# EAGLE schematic 180dof-pm (EAGLE 5.04)
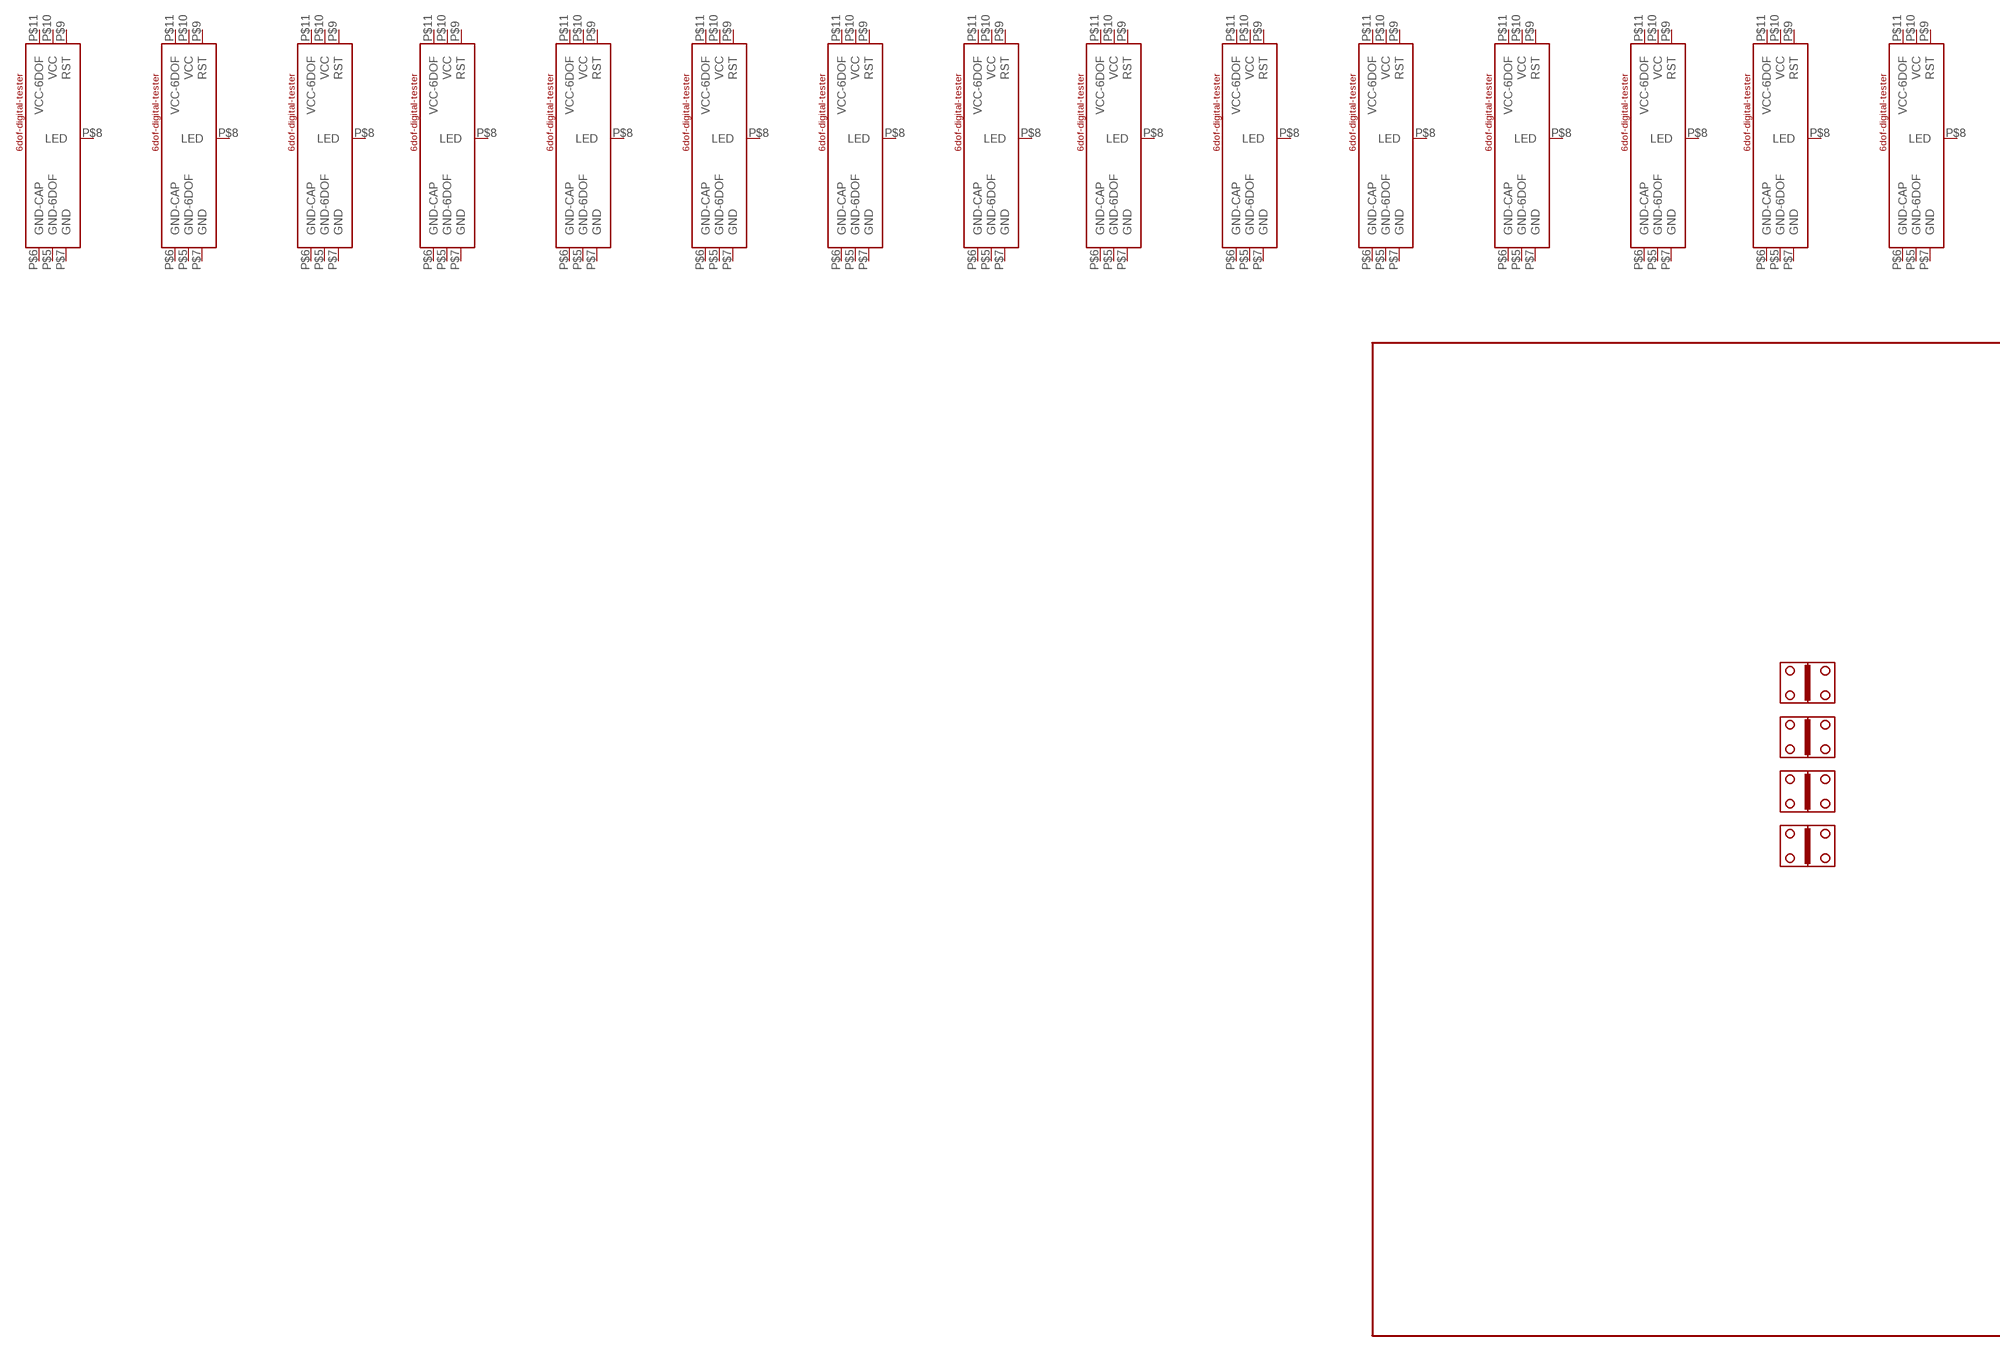
[diagram p0: schematic, sheet 1, part 1 of 2]
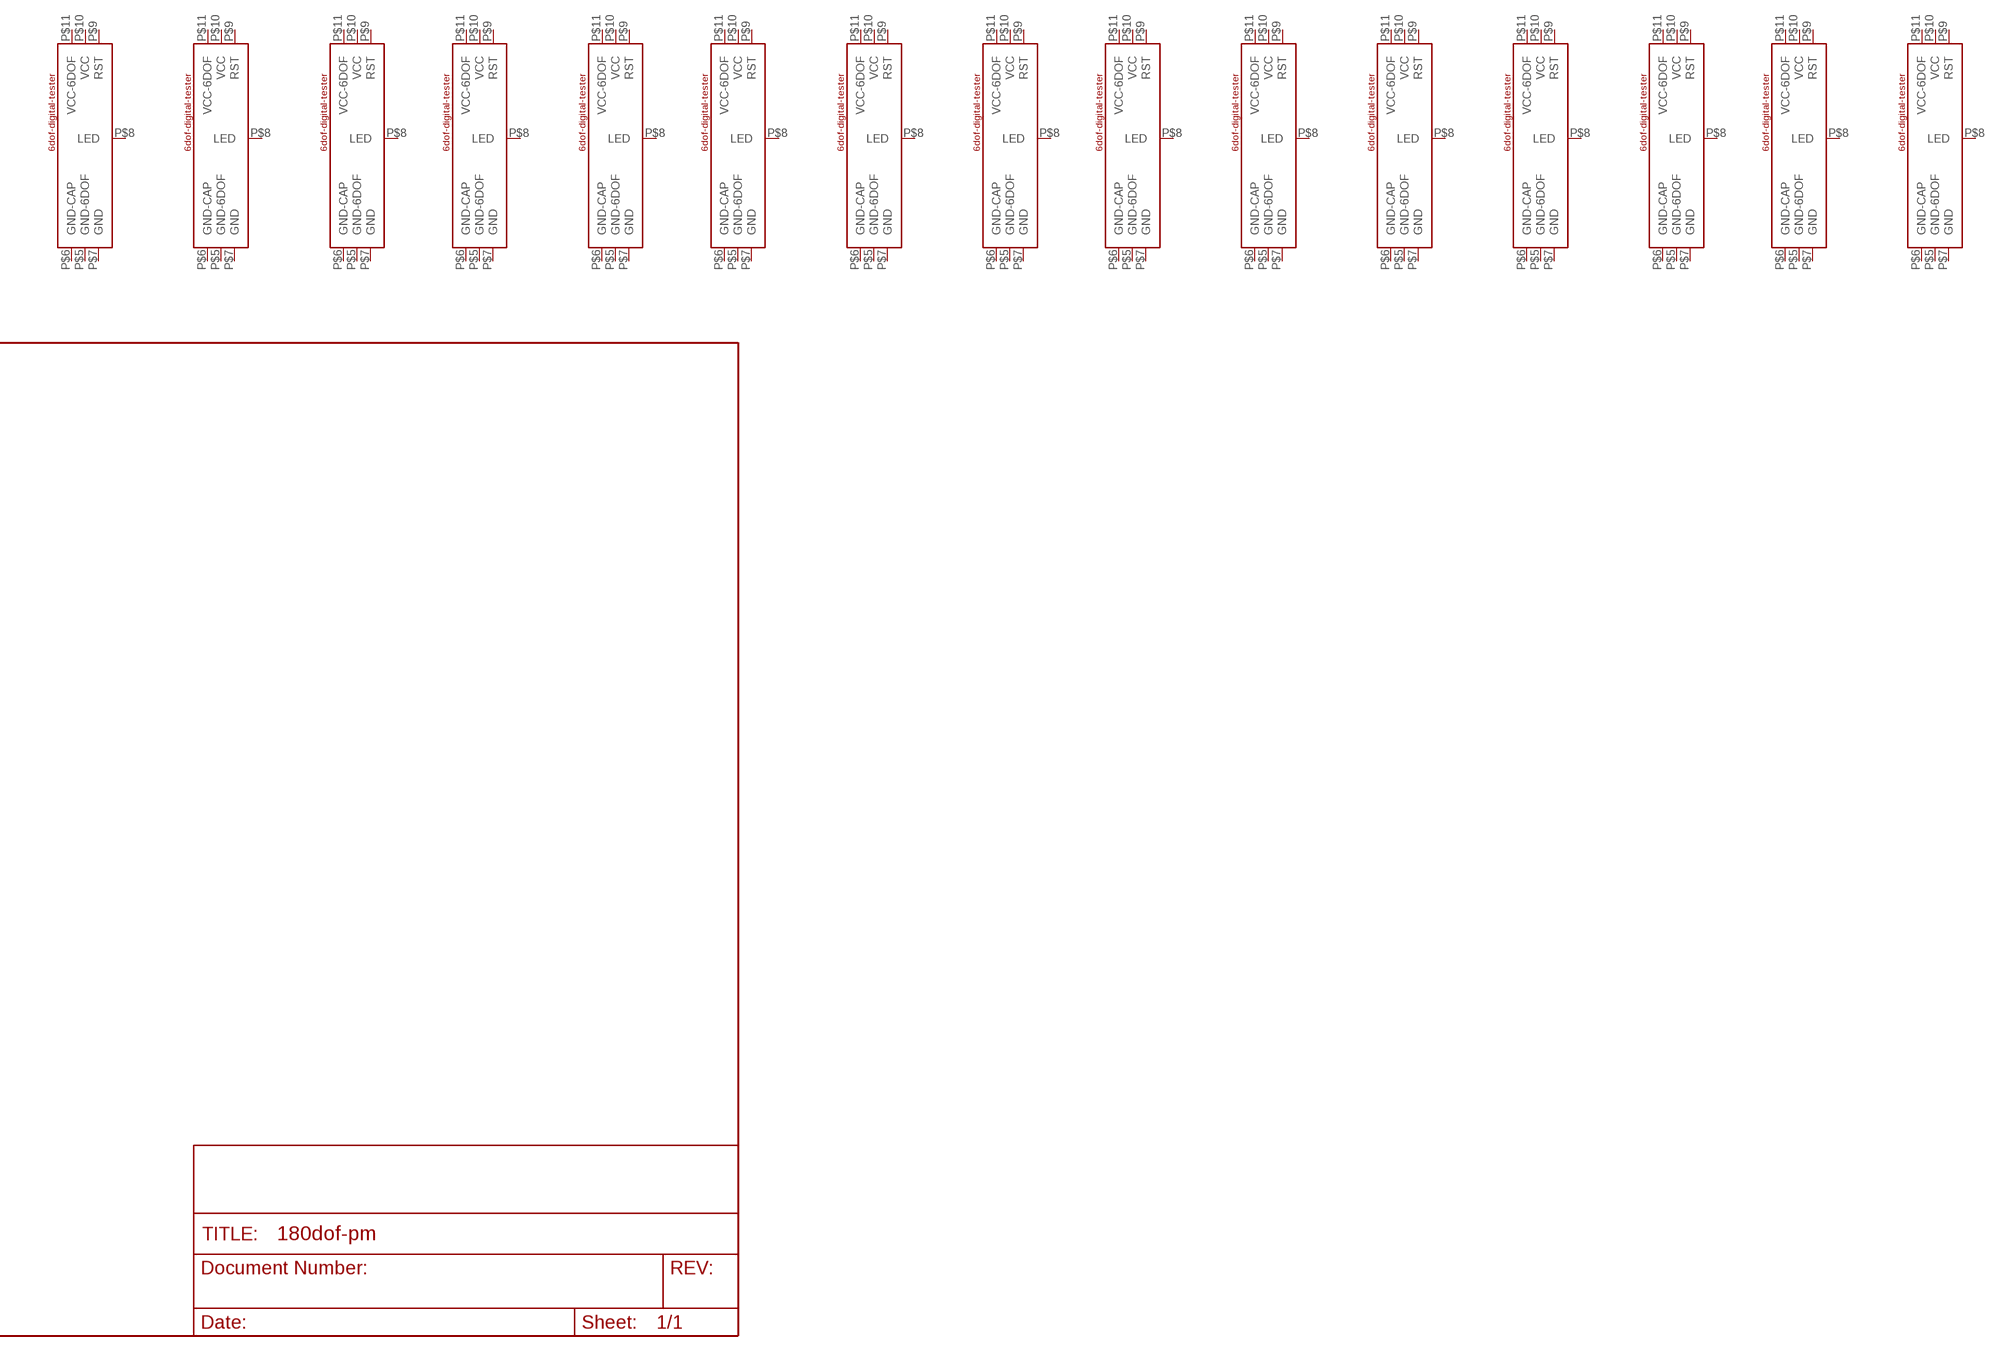
[diagram p1: schematic, sheet 1, part 2 of 2]

## Parts
U$1  6DOF-DIGITAL-TESTER-DEVPM  [6DOF-DIGITAL-TESTER-PM]
U$2  6DOF-DIGITAL-TESTER-DEVPM  [6DOF-DIGITAL-TESTER-PM]
U$3  6DOF-DIGITAL-TESTER-DEVPM  [6DOF-DIGITAL-TESTER-PM]
U$4  6DOF-DIGITAL-TESTER-DEVPM  [6DOF-DIGITAL-TESTER-PM]
U$5  6DOF-DIGITAL-TESTER-DEVPM  [6DOF-DIGITAL-TESTER-PM]
U$6  6DOF-DIGITAL-TESTER-DEVPM  [6DOF-DIGITAL-TESTER-PM]
U$7  6DOF-DIGITAL-TESTER-DEVPM  [6DOF-DIGITAL-TESTER-PM]
U$8  6DOF-DIGITAL-TESTER-DEVPM  [6DOF-DIGITAL-TESTER-PM]
U$9  6DOF-DIGITAL-TESTER-DEVPM  [6DOF-DIGITAL-TESTER-PM]
U$10  6DOF-DIGITAL-TESTER-DEVPM  [6DOF-DIGITAL-TESTER-PM]
U$11  6DOF-DIGITAL-TESTER-DEVPM  [6DOF-DIGITAL-TESTER-PM]
U$12  6DOF-DIGITAL-TESTER-DEVPM  [6DOF-DIGITAL-TESTER-PM]
U$13  6DOF-DIGITAL-TESTER-DEVPM  [6DOF-DIGITAL-TESTER-PM]
U$14  6DOF-DIGITAL-TESTER-DEVPM  [6DOF-DIGITAL-TESTER-PM]
U$15  6DOF-DIGITAL-TESTER-DEVPM  [6DOF-DIGITAL-TESTER-PM]
U$16  6DOF-DIGITAL-TESTER-DEVPM  [6DOF-DIGITAL-TESTER-PM]
U$17  6DOF-DIGITAL-TESTER-DEVPM  [6DOF-DIGITAL-TESTER-PM]
U$18  6DOF-DIGITAL-TESTER-DEVPM  [6DOF-DIGITAL-TESTER-PM]
U$19  6DOF-DIGITAL-TESTER-DEVPM  [6DOF-DIGITAL-TESTER-PM]
U$20  6DOF-DIGITAL-TESTER-DEVPM  [6DOF-DIGITAL-TESTER-PM]
U$21  6DOF-DIGITAL-TESTER-DEVPM  [6DOF-DIGITAL-TESTER-PM]
U$22  6DOF-DIGITAL-TESTER-DEVPM  [6DOF-DIGITAL-TESTER-PM]
U$23  6DOF-DIGITAL-TESTER-DEVPM  [6DOF-DIGITAL-TESTER-PM]
U$24  6DOF-DIGITAL-TESTER-DEVPM  [6DOF-DIGITAL-TESTER-PM]
U$25  6DOF-DIGITAL-TESTER-DEVPM  [6DOF-DIGITAL-TESTER-PM]
U$26  6DOF-DIGITAL-TESTER-DEVPM  [6DOF-DIGITAL-TESTER-PM]
U$27  6DOF-DIGITAL-TESTER-DEVPM  [6DOF-DIGITAL-TESTER-PM]
U$28  6DOF-DIGITAL-TESTER-DEVPM  [6DOF-DIGITAL-TESTER-PM]
U$29  6DOF-DIGITAL-TESTER-DEVPM  [6DOF-DIGITAL-TESTER-PM]
U$30  6DOF-DIGITAL-TESTER-DEVPM  [6DOF-DIGITAL-TESTER-PM]
U$48  GOLD_HINDGESTANDARD  [GOLD_HINDGE]
U$49  GOLD_HINDGESTANDARD  [GOLD_HINDGE]
U$50  GOLD_HINDGESTANDARD  [GOLD_HINDGE]
U$51  GOLD_HINDGESTANDARD  [GOLD_HINDGE]
Unconnected: U$1.P$5(GND-6DOF) U$1.P$6(GND-CAP) U$1.P$7(GND) U$1.P$8(LED) U$1.P$9(RST) U$1.P$10(VCC) U$1.P$11(VCC-6DOF) U$2.P$5(GND-6DOF) U$2.P$6(GND-CAP) U$2.P$7(GND) U$2.P$8(LED) U$2.P$9(RST) U$2.P$10(VCC) U$2.P$11(VCC-6DOF) U$3.P$5(GND-6DOF) U$3.P$6(GND-CAP) U$3.P$7(GND) U$3.P$8(LED) U$3.P$9(RST) U$3.P$10(VCC) U$3.P$11(VCC-6DOF) U$4.P$5(GND-6DOF) U$4.P$6(GND-CAP) U$4.P$7(GND) U$4.P$8(LED) U$4.P$9(RST) U$4.P$10(VCC) U$4.P$11(VCC-6DOF) U$5.P$5(GND-6DOF) U$5.P$6(GND-CAP) U$5.P$7(GND) U$5.P$8(LED) U$5.P$9(RST) U$5.P$10(VCC) U$5.P$11(VCC-6DOF) U$6.P$5(GND-6DOF) U$6.P$6(GND-CAP) U$6.P$7(GND) U$6.P$8(LED) U$6.P$9(RST) U$6.P$10(VCC) U$6.P$11(VCC-6DOF) U$7.P$5(GND-6DOF) U$7.P$6(GND-CAP) U$7.P$7(GND) U$7.P$8(LED) U$7.P$9(RST) U$7.P$10(VCC) U$7.P$11(VCC-6DOF) U$8.P$5(GND-6DOF) U$8.P$6(GND-CAP) U$8.P$7(GND) U$8.P$8(LED) U$8.P$9(RST) U$8.P$10(VCC) U$8.P$11(VCC-6DOF) U$9.P$5(GND-6DOF) U$9.P$6(GND-CAP) U$9.P$7(GND) U$9.P$8(LED) U$9.P$9(RST) U$9.P$10(VCC) U$9.P$11(VCC-6DOF) U$10.P$5(GND-6DOF) U$10.P$6(GND-CAP) U$10.P$7(GND) U$10.P$8(LED) U$10.P$9(RST) U$10.P$10(VCC) U$10.P$11(VCC-6DOF) U$11.P$5(GND-6DOF) U$11.P$6(GND-CAP) U$11.P$7(GND) U$11.P$8(LED) U$11.P$9(RST) U$11.P$10(VCC) U$11.P$11(VCC-6DOF) U$12.P$5(GND-6DOF) U$12.P$6(GND-CAP) U$12.P$7(GND) U$12.P$8(LED) U$12.P$9(RST) U$12.P$10(VCC) U$12.P$11(VCC-6DOF) U$13.P$5(GND-6DOF) U$13.P$6(GND-CAP) U$13.P$7(GND) U$13.P$8(LED) U$13.P$9(RST) U$13.P$10(VCC) U$13.P$11(VCC-6DOF) U$14.P$5(GND-6DOF) U$14.P$6(GND-CAP) U$14.P$7(GND) U$14.P$8(LED) U$14.P$9(RST) U$14.P$10(VCC) U$14.P$11(VCC-6DOF) U$15.P$5(GND-6DOF) U$15.P$6(GND-CAP) U$15.P$7(GND) U$15.P$8(LED) U$15.P$9(RST) U$15.P$10(VCC) U$15.P$11(VCC-6DOF) U$16.P$5(GND-6DOF) U$16.P$6(GND-CAP) U$16.P$7(GND) U$16.P$8(LED) U$16.P$9(RST) U$16.P$10(VCC) U$16.P$11(VCC-6DOF) U$17.P$5(GND-6DOF) U$17.P$6(GND-CAP) U$17.P$7(GND) U$17.P$8(LED) U$17.P$9(RST) U$17.P$10(VCC) U$17.P$11(VCC-6DOF) U$18.P$5(GND-6DOF) U$18.P$6(GND-CAP) U$18.P$7(GND) U$18.P$8(LED) U$18.P$9(RST) U$18.P$10(VCC) U$18.P$11(VCC-6DOF) U$19.P$5(GND-6DOF) U$19.P$6(GND-CAP) U$19.P$7(GND) U$19.P$8(LED) U$19.P$9(RST) U$19.P$10(VCC) U$19.P$11(VCC-6DOF) U$20.P$5(GND-6DOF) U$20.P$6(GND-CAP) U$20.P$7(GND) U$20.P$8(LED) U$20.P$9(RST) U$20.P$10(VCC) U$20.P$11(VCC-6DOF) U$21.P$5(GND-6DOF) U$21.P$6(GND-CAP) U$21.P$7(GND) U$21.P$8(LED) U$21.P$9(RST) U$21.P$10(VCC) U$21.P$11(VCC-6DOF) U$22.P$5(GND-6DOF) U$22.P$6(GND-CAP) U$22.P$7(GND) U$22.P$8(LED) U$22.P$9(RST) U$22.P$10(VCC) U$22.P$11(VCC-6DOF) U$23.P$5(GND-6DOF) U$23.P$6(GND-CAP) U$23.P$7(GND) U$23.P$8(LED) U$23.P$9(RST) U$23.P$10(VCC) U$23.P$11(VCC-6DOF) U$24.P$5(GND-6DOF) U$24.P$6(GND-CAP) U$24.P$7(GND) U$24.P$8(LED) U$24.P$9(RST) U$24.P$10(VCC) U$24.P$11(VCC-6DOF) U$25.P$5(GND-6DOF) U$25.P$6(GND-CAP) U$25.P$7(GND) U$25.P$8(LED) U$25.P$9(RST) U$25.P$10(VCC) U$25.P$11(VCC-6DOF) U$26.P$5(GND-6DOF) U$26.P$6(GND-CAP) U$26.P$7(GND) U$26.P$8(LED) U$26.P$9(RST) U$26.P$10(VCC) U$26.P$11(VCC-6DOF) U$27.P$5(GND-6DOF) U$27.P$6(GND-CAP) U$27.P$7(GND) U$27.P$8(LED) U$27.P$9(RST) U$27.P$10(VCC) U$27.P$11(VCC-6DOF) U$28.P$5(GND-6DOF) U$28.P$6(GND-CAP) U$28.P$7(GND) U$28.P$8(LED) U$28.P$9(RST) U$28.P$10(VCC) U$28.P$11(VCC-6DOF) U$29.P$5(GND-6DOF) U$29.P$6(GND-CAP) U$29.P$7(GND) U$29.P$8(LED) U$29.P$9(RST) U$29.P$10(VCC) U$29.P$11(VCC-6DOF) U$30.P$5(GND-6DOF) U$30.P$6(GND-CAP) U$30.P$7(GND) U$30.P$8(LED) U$30.P$9(RST) U$30.P$10(VCC) U$30.P$11(VCC-6DOF)

## Library data of the parts
U$1-U$30 = Testing:6DOF-DIGITAL-TESTER-DEV
U$48-U$51 = JoelEB:GOLD_HINDGE